# EAGLE design JDM2_Low_Voltage (EAGLE 7.2.0)
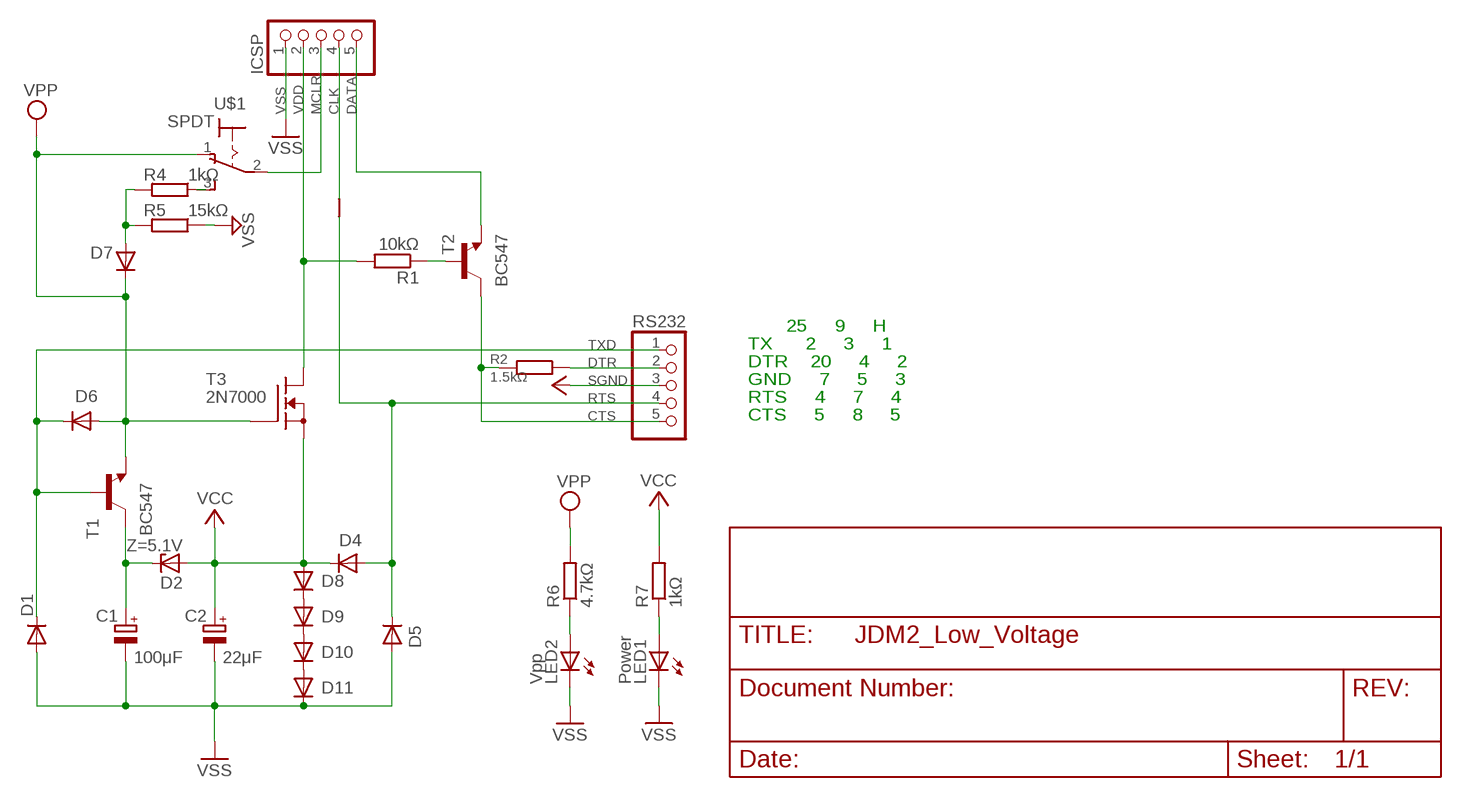
[diagram p0: schematic, sheet 1]

## Parts
C1  100μF  CPOL-EUE2.5-5  [E2,5-5]
C2  22μF  CPOL-EUE2.5-5  [E2,5-5]
D1  1N4148  1N4148-7  [DO35-7]
D2  Z=5.1V  Z-DIODEZ5  [DO35Z5]
D4  1N4148  1N4148-2.54  [DO35-2_54]
D5  1N4148  1N4148-18  [DO34-18]
D6  1N4148  1N4148-2.54A  [DO35-2_54A]
D7  2N4148  1N4148-2.54A  [DO35-2_54A]
D8  1N4148  1N4148-2.54A  [DO35-2_54A]
D9  1N4148  1N4148-2.54A  [DO35-2_54A]
D10  1N4148  1N4148-2.54A  [DO35-2_54A]
D11  1N4148  1N4148-2.54A  [DO35-2_54A]
ICSP  PINHD-1X5  [1X05]
J1  DUMMY  [DUMMY]
LED1  Power  LED  [LED5MM]
LED2  Vpp  LED  [LED5MM]
R1  10kΩ  RES-0207-10  [0207/10]
R2  1.5kΩ  RES-0204-7  [0204/7]
R4  1kΩ  RES-0207-10  [0207/10]
R5  15kΩ  RES-0207-10  [0207/10]
R6  4.7kΩ  RES-0204-7  [0204/7]
R7  1kΩ  RES-0204-7  [0204/7]
RS232  PINHD-1X5  [1X05]
T1  BC547  [TO92-CBE]
T2  BC547  [TO92-CBE]
T3  2N7000  [TO92]
U$1  SPDT  [SPDT]

## Nets
2N3904: C1.+ D2.C T1.C
CLK: ICSP.4 J1.2
CTS: R2.2 RS232.5 T2.C
DATA: ICSP.5 T2.E
DTR: R2.1 RS232.2
MCLR: ICSP.3 U$1.2(P)
N$1: R1.1 T2.B
N$2: LED1.A R7.1
N$3: LED2.A R6.1
N$4: R4.1 U$1.3(S)
N$5: D10.C D11.A
N$6: D9.C D10.A
N$7: D8.C D9.A
N$10: D7.A R4.2 R5.2
RTS: D4.A D5.C J1.1 RS232.4
SGND: C2.+ D2.A D4.C D8.A R7.2 RS232.3 T3.1(S) ; supply symbol labelled VCC
TXD: D1.C D6.C RS232.1 T1.B
VDD: ICSP.2 R1.2 T3.3(D)
VPP: D6.A D7.C R6.2 T1.E T3.2(G) U$1.1(O)
VSS: C1.- C2.- D1.A D5.A D11.C ICSP.1 LED1.K(C) LED2.K(C) R5.1

## Notes on the sheet
- 25     9     H
- TX      2     3     1
- DTR    20     4     2
- GND     7     5     3
- RTS     4     7     4
- CTS     5     8     5

## Library data of the parts
C1 C2 = rcl:CPOL-EU: POLARIZED CAPACITOR, European symbol
D1 D4-D11 = JDM2:1N4148
D2 = JDM2:Z-DIODE
ICSP RS232 = pinhead:PINHD-1X5: PIN HEADER
J1 = JDM2:DUMMY
LED1 LED2 = 1dmf:LED
R1 R2 R4-R7 = JDM2:RES
T1 T2 = JDM2:BC547
T3 = JDM2:2N7000
U$1 = JDM2:SPDT

## Net classes
0 default: width 0.559 mm
1 power: width 0.559 mm

## Board
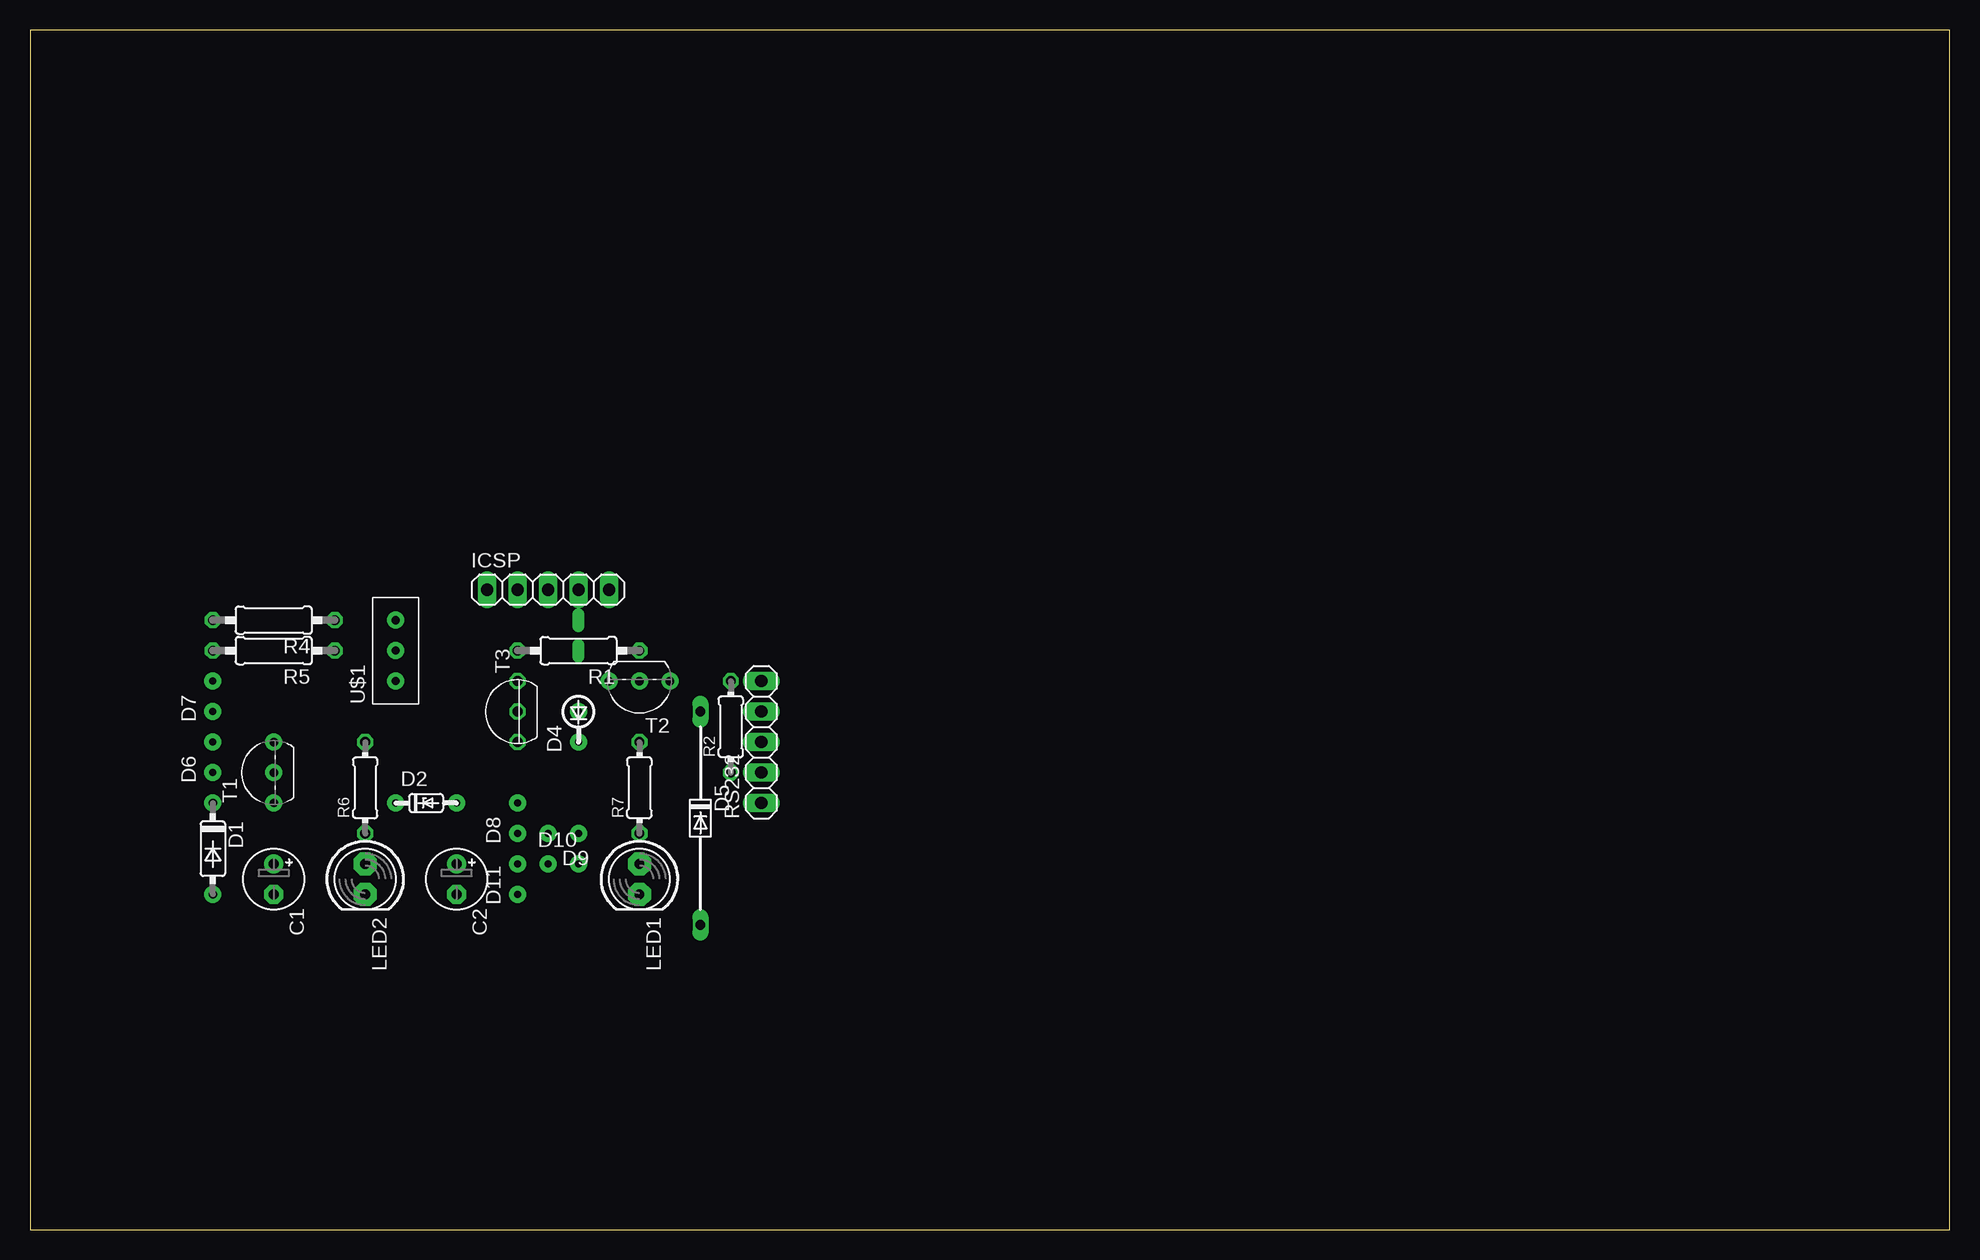
[diagram p1: board, top side]
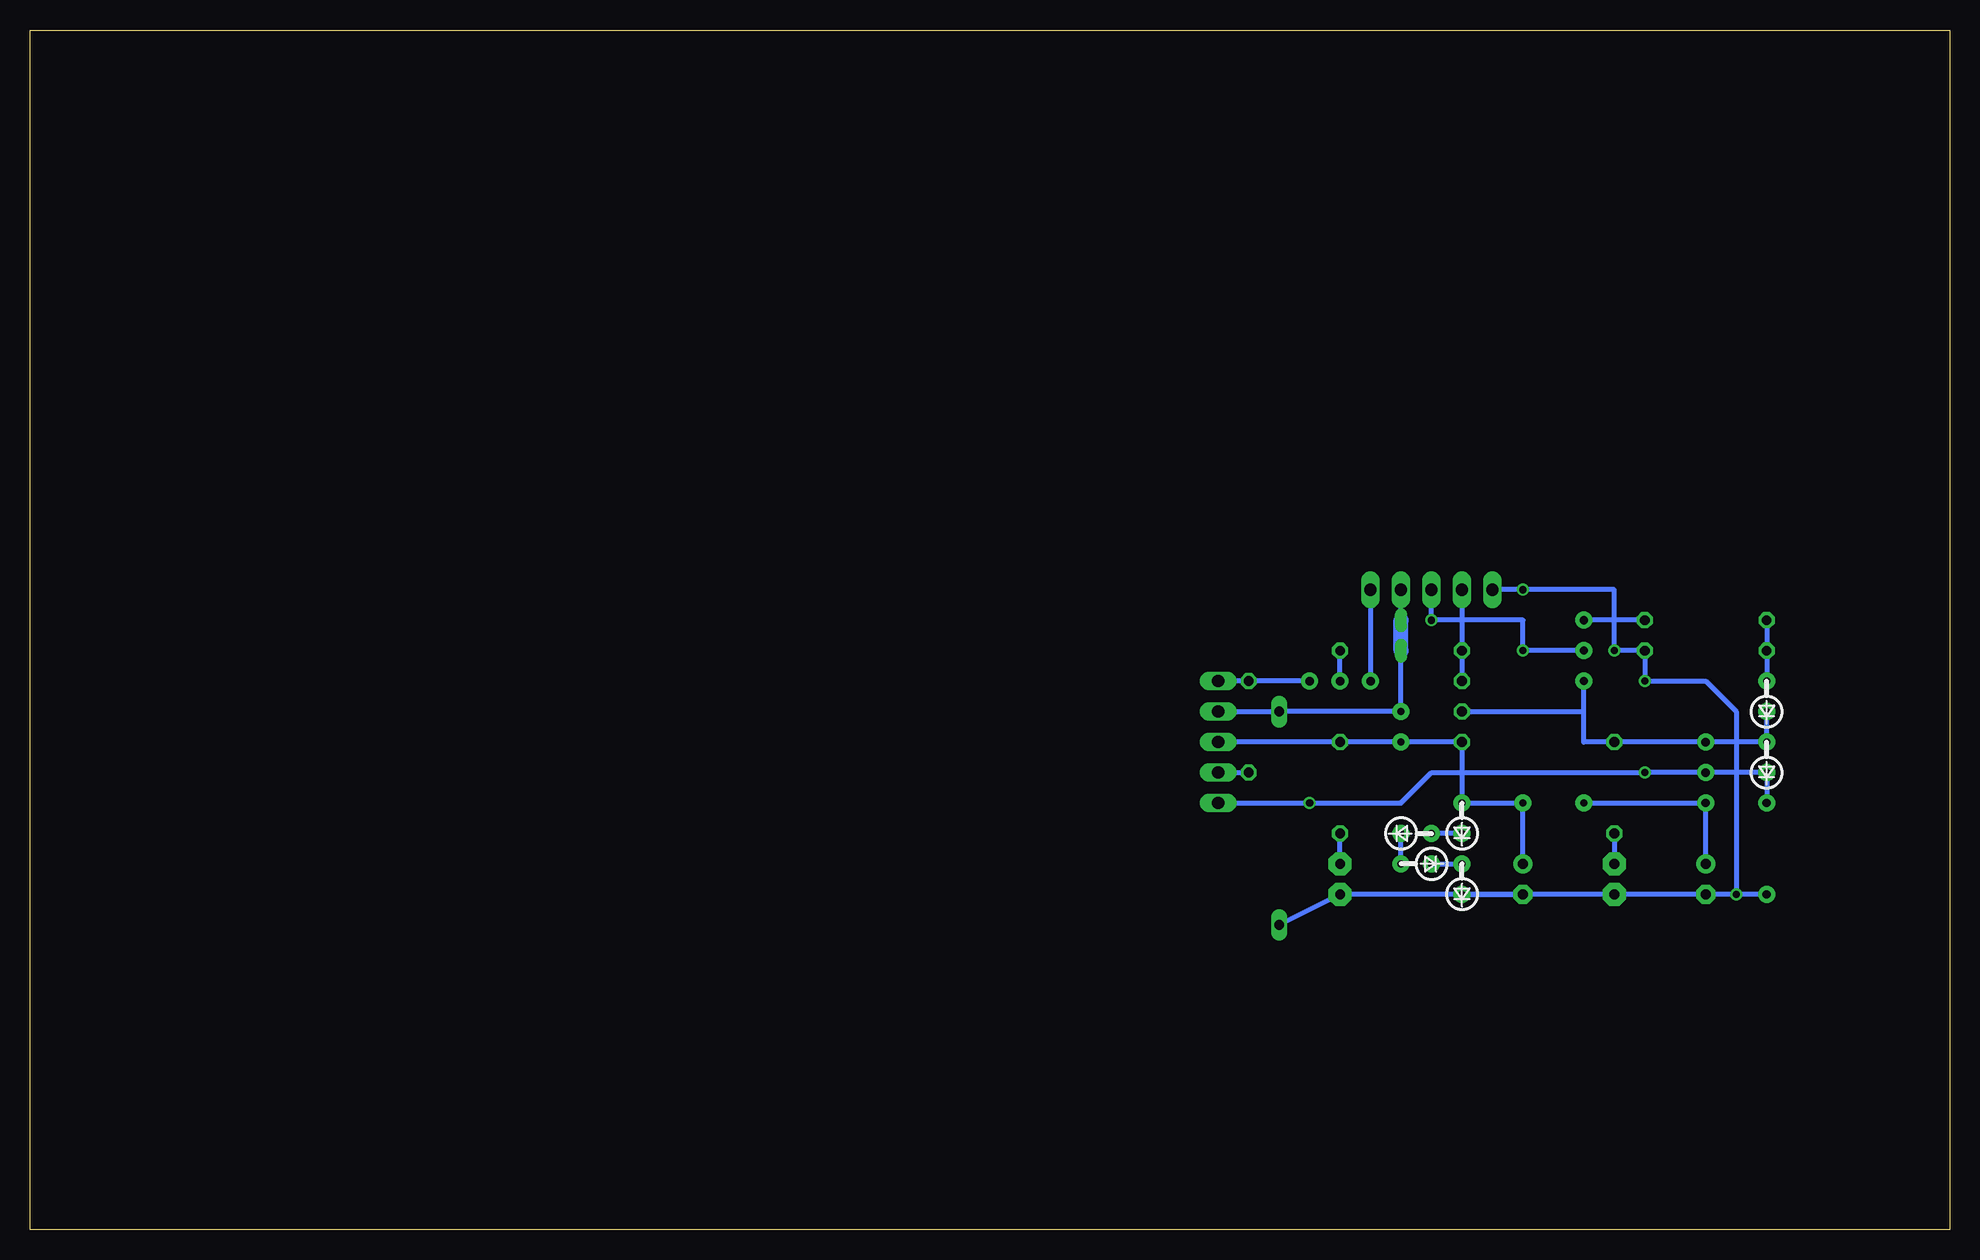
[diagram p2: board, bottom side, seen from below]

Size 160 x 100 mm. Coordinates in mm from the lower left corner, seen from the top.
Outline: 0,0 160,0 160,100 0,100 0,0
Copper layers (1*16): layer 1 0.035mm / dielectric 1.5mm / Bottom 0.035mm
Design rules "default": minimum track width 10mil, minimum drill 24mil, track to track 8mil, track to pad 8mil, pad to pad 8mil, via to via 8mil, smd to smd 8mil, copper to edge 40mil, drill to drill 8mil, minimum pad ring 10mil, minimum via ring 8mil, stop-mask expansion 4mil, vias tented up to drill 0mil, thermal gap 10mil

### Footprints (pad centres in the part's own frame; a part is rotated, then mirrored left to right if it is on the bottom)
E2,5-5 = drill 0.813 pad 1.6: + -1.27,0 | drill 0.813 pad 1.6 octagon: - 1.27,0
DO35-7 = drill 0.7 pad 1.422: A 3.81,0; C -3.81,0
DO35Z5 = drill 0.6 pad 1.422: A 2.54,0; C -2.54,0
DO35-2_54 = drill 0.6 pad 1.422: A 1.27,0; C -1.27,0
DO34-18 = drill 0.813 long: A 8.89,0; C -8.89,0
DO35-2_54A = drill 0.6 pad 1.422: A 1.27,0; C -1.27,0
1X05 = drill 1.016 long: 1 -5.08,0; 2 -2.54,0; 3 0,0; 4 2.54,0; 5 5.08,0
DUMMY = drill 0.003 pad 1.016 long: 1 -1.27,0; 2 1.27,0
LED5MM = drill 0.813 pad 1.93 octagon: A -1.27,0; K 1.27,0
0207/10 = drill 0.813 octagon: 1 -5.08,0; 2 5.08,0
0204/7 = drill 0.813 octagon: 1 -3.81,0; 2 3.81,0
TO92-CBE = drill 0.7 pad 1.422: B 0,0; C -2.54,0; E 2.54,0
TO92 = drill 0.813 octagon: 1 -2.54,0; 2 0,0; 3 2.54,0
SPDT = drill 0.686 pad 1.422: 1 -2.54,0; 2 0,0; 3 2.54,0

### Placement (x,y rotation side)
C1  20.32,29.21 270 top
C2  35.56,29.21 270 top
D1  15.24,31.75 270 top
D2  33.02,35.56 0 top
D4  45.72,41.91 90 top
D5  55.88,34.29 270 top
D6  15.24,39.37 90 top
D7  15.24,44.45 90 top
D8  40.64,34.29 90 top
D9  44.45,33.02 180 top
D10  44.45,30.48 0 top
D11  40.64,29.21 90 top
ICSP  43.18,53.34 0 top
J1  45.72,49.53 90 top
LED1  50.8,29.21 270 top
LED2  27.94,29.21 270 top
R1  45.72,48.26 180 top
R2  58.42,41.91 90 top
R4  20.32,50.8 180 top
R5  20.32,48.26 180 top
R6  27.94,36.83 90 top
R7  50.8,36.83 90 top
RS232  60.96,40.64 90 top
T1  20.32,38.1 90 top
T2  50.8,45.72 180 top
T3  40.64,43.18 90 top
U$1  30.48,48.26 90 top

### Tracks (layer width: path | path; a pad name or v marks a point on that pad's centre or on a via)
2N3904
  Bottom 0.406: D2.C T1.C C1.+
CLK
  Bottom 0.406: J1.2 ICSP.4
CTS
  Bottom 0.406: T2.C R2.2 RS232.5
DATA
  Bottom 0.406: ICSP.5 T2.E
DTR
  Bottom 0.406: RS232.2 R2.1
MCLR  (via drill 0.6 layers 16-16)
  Bottom 0.406: U$1.2 v35.56,48.26 35.56,50.8 v43.18,50.8 ICSP.3
N$1
  Bottom 0.406: T2.B R1.1
N$2
  Bottom 0.406: LED1.A R7.1
N$3
  Bottom 0.406: R6.1 LED2.A
N$4
  Bottom 0.406: R4.1 U$1.3
N$5
  Bottom 0.406: D10.C D11.A
N$6
  Bottom 0.406: D10.A D9.C
N$7
  Bottom 0.406: D8.C D9.A
N$10
  Bottom 0.406: R4.2 R5.2 D7.A
RTS
  Bottom 0.406: RS232.4 D5.C D4.A J1.1
SGND
  Bottom 0.406: RS232.3 R7.2 D4.C T3.1 D8.A D2.A C2.+
TXD  (via drill 0.6 layers 16-16)
  Bottom 0.406: D1.C D6.C T1.B v25.4,38.1 43.18,38.1 45.72,35.56 v53.34,35.56 RS232.1
VDD
  Bottom 0.406: ICSP.2 R1.2 T3.3
VPP
  Bottom 0.406: 30.48,43.18 30.48,40.64 R6.2 T1.E D6.A D7.C | 30.48,43.18 U$1.1 | T3.2 30.48,43.18
VSS  (via drill 0.6 layers 16-16)
  Bottom 0.406: v17.78,27.94 17.78,43.18 20.32,45.72 v25.4,45.72 R5.1 v27.94,48.26 27.94,53.34 v35.56,53.34 ICSP.1 | D11.C C2.- | C2.- LED1.K D5.A | D1.A v17.78,27.94 | v17.78,27.94 C1.- LED2.K C2.-